# EAGLE design colecovision2 (EAGLE 7.4.0)
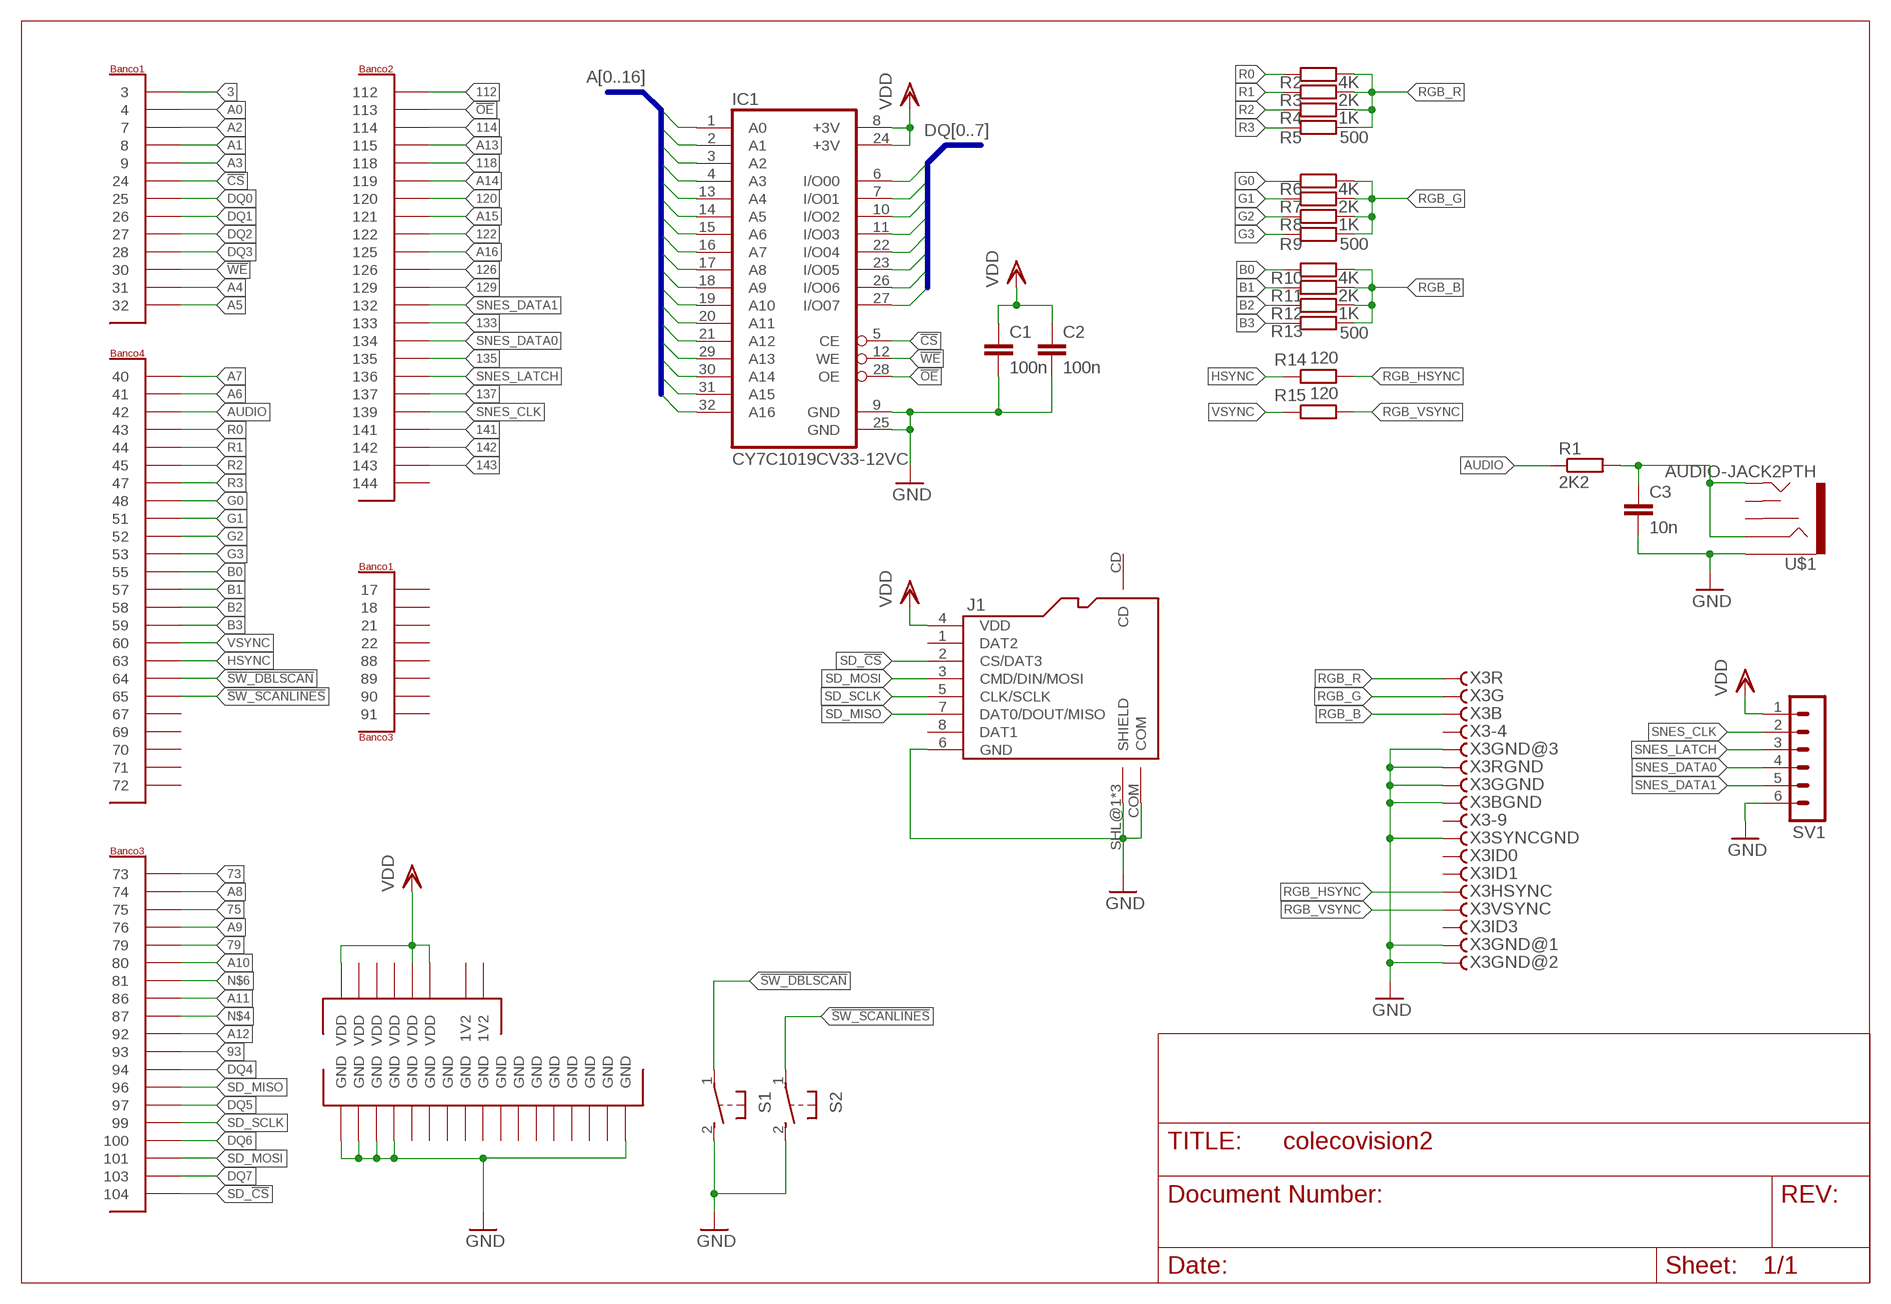
[diagram p0: schematic, sheet 1]

## Parts
C1  100n  C-EUC1206  [C1206]
C2  100n  C-EUC1206  [C1206]
C3  10n  C-EUC1206  [C1206]
IC1  CY7C1019CV33-12VC  [SOJ32-400]
J1  MICROSD-9P  [9P-SMD-W/-RING]
PLC1  PLACAEP2C5LASER  [4X28_LASER]
R1  2K2  R-EU_R1206  [R1206]
R2  4K  R-EU_R1206  [R1206]
R3  2K  R-EU_R1206  [R1206]
R4  1K  R-EU_R1206  [R1206]
R5  500  R-EU_R1206  [R1206]
R6  4K  R-EU_R1206  [R1206]
R7  2K  R-EU_R1206  [R1206]
R8  1K  R-EU_R1206  [R1206]
R9  500  R-EU_R1206  [R1206]
R10  4K  R-EU_R1206  [R1206]
R11  2K  R-EU_R1206  [R1206]
R12  1K  R-EU_R1206  [R1206]
R13  500  R-EU_R1206  [R1206]
R14  120  R-EU_R1206  [R1206]
R15  120  R-EU_R1206  [R1206]
S1  31-XX  [B3F-31XX]
S2  31-XX  [B3F-31XX]
SV1  MA06-1  [MA06-1]
U$1  AUDIO-JACK2PTH  [AUDIO-JACK]
X3  VGAH  [HDF15H]

## Nets
3: PLC1.P$3
73: PLC1.P$59
75: PLC1.P$61
79: PLC1.P$63
93: PLC1.P$73
112: PLC1.P$87
114: PLC1.P$89
118: PLC1.P$91
120: PLC1.P$93
122: PLC1.P$95
126: PLC1.P$97
129: PLC1.P$98
133: PLC1.P$100
135: PLC1.P$102
137: PLC1.P$104
141: PLC1.P$106
142: PLC1.P$107
143: PLC1.P$108
!CS: IC1.5(CE) PLC1.P$16
!OE: IC1.28(OE) PLC1.P$88
!SW_DBLSCAN: PLC1.P$46 S1.1(P)
!SW_SCANLINES: PLC1.P$47 S2.1(P)
!WE: IC1.12(WE) PLC1.P$21
A0: IC1.1(A0) PLC1.P$4
A1: IC1.2(A1) PLC1.P$6
A2: IC1.3(A2) PLC1.P$5
A3: IC1.4(A3) PLC1.P$7
A4: IC1.13(A4) PLC1.P$24
A5: IC1.14(A5) PLC1.P$23
A6: IC1.15(A6) PLC1.P$30
A7: IC1.16(A7) PLC1.P$29
A8: IC1.17(A8) PLC1.P$60
A9: IC1.18(A9) PLC1.P$62
A10: IC1.19(A10) PLC1.P$64
A11: IC1.20(A11) PLC1.P$66
A12: IC1.21(A12) PLC1.P$72
A13: IC1.29(A13) PLC1.P$90
A14: IC1.30(A14) PLC1.P$92
A15: IC1.31(A15) PLC1.P$94
A16: IC1.32(A16) PLC1.P$96
AUDIO: PLC1.P$31 R1.1
B0: PLC1.P$40 R10.1
B1: PLC1.P$41 R11.1
B2: PLC1.P$42 R12.1
B3: PLC1.P$43 R13.1
DQ0: IC1.6(I/O00) PLC1.P$15
DQ1: IC1.7(I/O01) PLC1.P$18
DQ2: IC1.10(I/O02) PLC1.P$17
DQ3: IC1.11(I/O03) PLC1.P$22
DQ4: IC1.22(I/O04) PLC1.P$74
DQ5: IC1.23(I/O05) PLC1.P$76
DQ6: IC1.26(I/O06) PLC1.P$78
DQ7: IC1.27(I/O07) PLC1.P$80
G0: PLC1.P$36 R6.1
G1: PLC1.P$37 R7.1
G2: PLC1.P$38 R8.1
G3: PLC1.P$39 R9.1
GND: C1.2 C2.2 C3.2 IC1.9(GND) IC1.25(GND) J1.6(GND) J1.COM J1.SHL@1(SHIELD) J1.SHL@2(SHIELD) J1.SHL@3(SHIELD) PLC1.P$1(GND) PLC1.P$2(GND) PLC1.P$8(GND) PLC1.P$9(GND) PLC1.P$111(GND) S1.2(S) S2.2(S) SV1.6 U$1.SLEEVE X3.5 X3.6 X3.7 X3.8 X3.10 X3.GND@1 X3.GND@2
HSYNC: PLC1.P$45 R14.1
N$1: C3.1 R1.2 U$1.RING U$1.TIP
N$4: PLC1.P$67
N$6: PLC1.P$65
R0: PLC1.P$32 R2.1
R1: PLC1.P$33 R3.1
R2: PLC1.P$34 R4.1
R3: PLC1.P$35 R5.1
RGB_B: R10.2 R11.2 R12.2 R13.2 X3.3
RGB_G: R6.2 R7.2 R8.2 R9.2 X3.2
RGB_HSYNC: R14.2 X3.13
RGB_R: R2.2 R3.2 R4.2 R5.2 X3.1
RGB_VSYNC: R15.2 X3.14
SD_!CS: J1.2(CS/DAT3) PLC1.P$81
SD_MISO: J1.7(DAT0/DOUT/MISO) PLC1.P$75
SD_MOSI: J1.3(CMD/DIN/MOSI) PLC1.P$79
SD_SCLK: J1.5(CLK/SCLK) PLC1.P$77
SNES_CLK: PLC1.P$105 SV1.2
SNES_DATA0: PLC1.P$101 SV1.4
SNES_DATA1: PLC1.P$99 SV1.5
SNES_LATCH: PLC1.P$103 SV1.3
VDD: C1.1 C2.1 IC1.8(+3V) IC1.24(+3V) J1.4(VDD) PLC1.P$27(VDD) PLC1.P$84(VDD) PLC1.P$112(VDD) SV1.1
VSYNC: PLC1.P$44 R15.1
Unconnected: J1.1(DAT2) J1.8(DAT1) J1.CD PLC1.P$11 PLC1.P$12 PLC1.P$13 PLC1.P$14 PLC1.P$48 PLC1.P$49 PLC1.P$50 PLC1.P$51 PLC1.P$52 PLC1.P$68 PLC1.P$69 PLC1.P$70 PLC1.P$71 PLC1.P$109 U$1.RSH U$1.TSH X3.4 X3.9 X3.11 X3.12 X3.15

## Buses
A[0..16]
DQ[0..7]

## Power pins joined to a net without a drawn wire
1V2: PLC1.P$19(1V2) PLC1.P$20(1V2)
GND: PLC1.P$10(GND) PLC1.P$25(GND) PLC1.P$26(GND) PLC1.P$53(GND) PLC1.P$54(GND) PLC1.P$57(GND) PLC1.P$58(GND) PLC1.P$82(GND) PLC1.P$83(GND) PLC1.P$85(GND) PLC1.P$86(GND) PLC1.P$110(GND)
VDD: PLC1.P$28(VDD) PLC1.P$55(VDD) PLC1.P$56(VDD)

## Library data of the parts
C1-C3 = rcl:C-EU: CAPACITOR, European symbol
IC1 = sram:CY7C1019CV33: 128K x 8 Static RAM 10ns Source: Cypress CYP05780611.pdf
J1 = fabio:MICROSD-9P: Micro SD 9 pins
PLC1 = placaEP2:PLACAEP2C5: Placa EP2C5
R1-R15 = rcl:R-EU_: RESISTOR, European symbol
S1 S2 = switch-omron:31-XX: OMRON SWITCH; MPN: B3F-3100; OC_FARNELL: 959704; OC_NEWARK: 36M3582
SV1 = con-lstb2:MA06-1: PIN HEADER; OC_FARNELL: unknown; OC_NEWARK: unknown
U$1 = fabio:AUDIO-JACK2: Stereo audio jack with bypass switches.
X3 = fabio:VGA: SUB-D; OC_FARNELL: unknown; OC_NEWARK: unknown

## Board
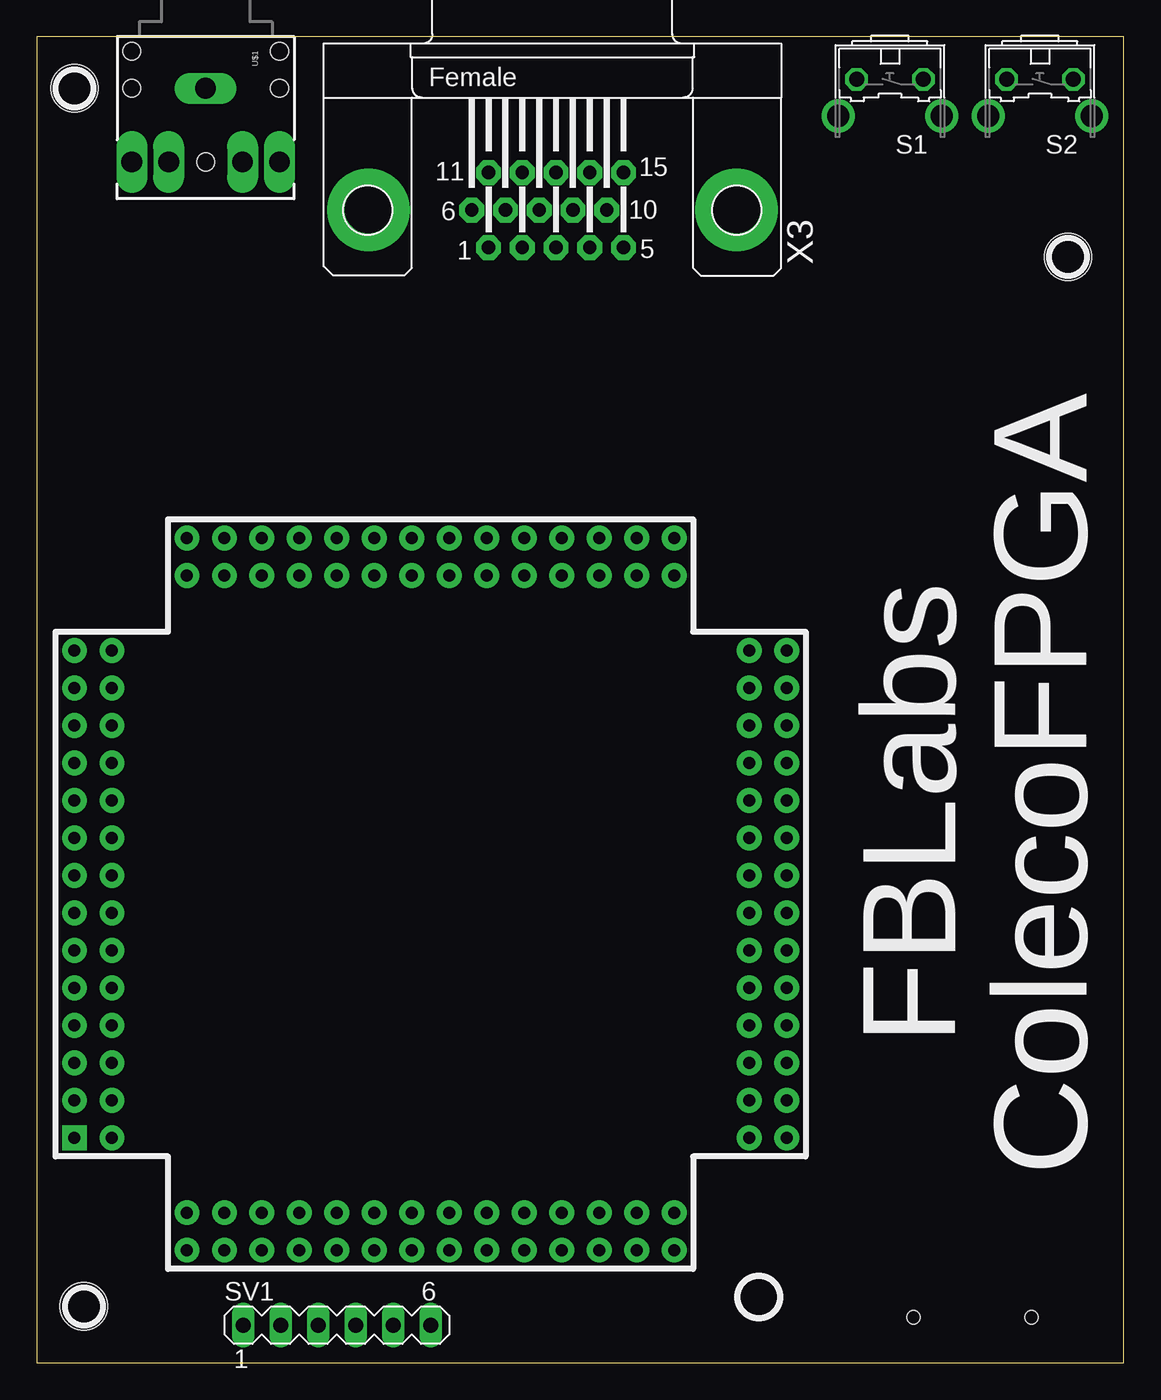
[diagram p1: board, top side]
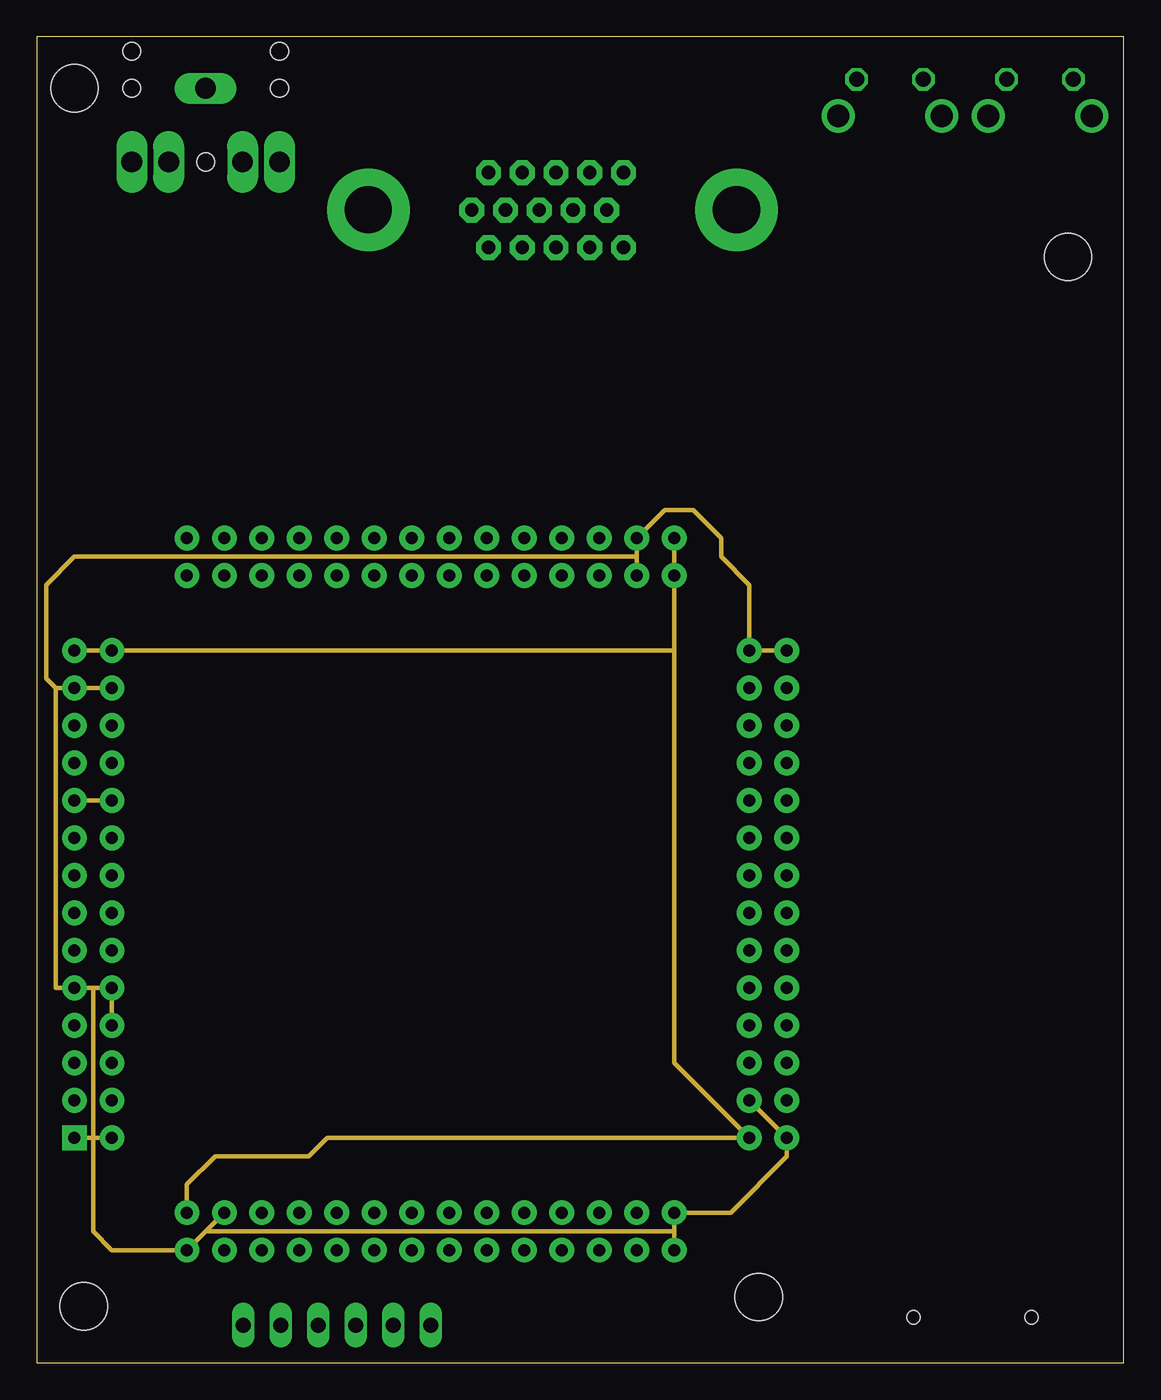
[diagram p2: board, inner layer Route8]
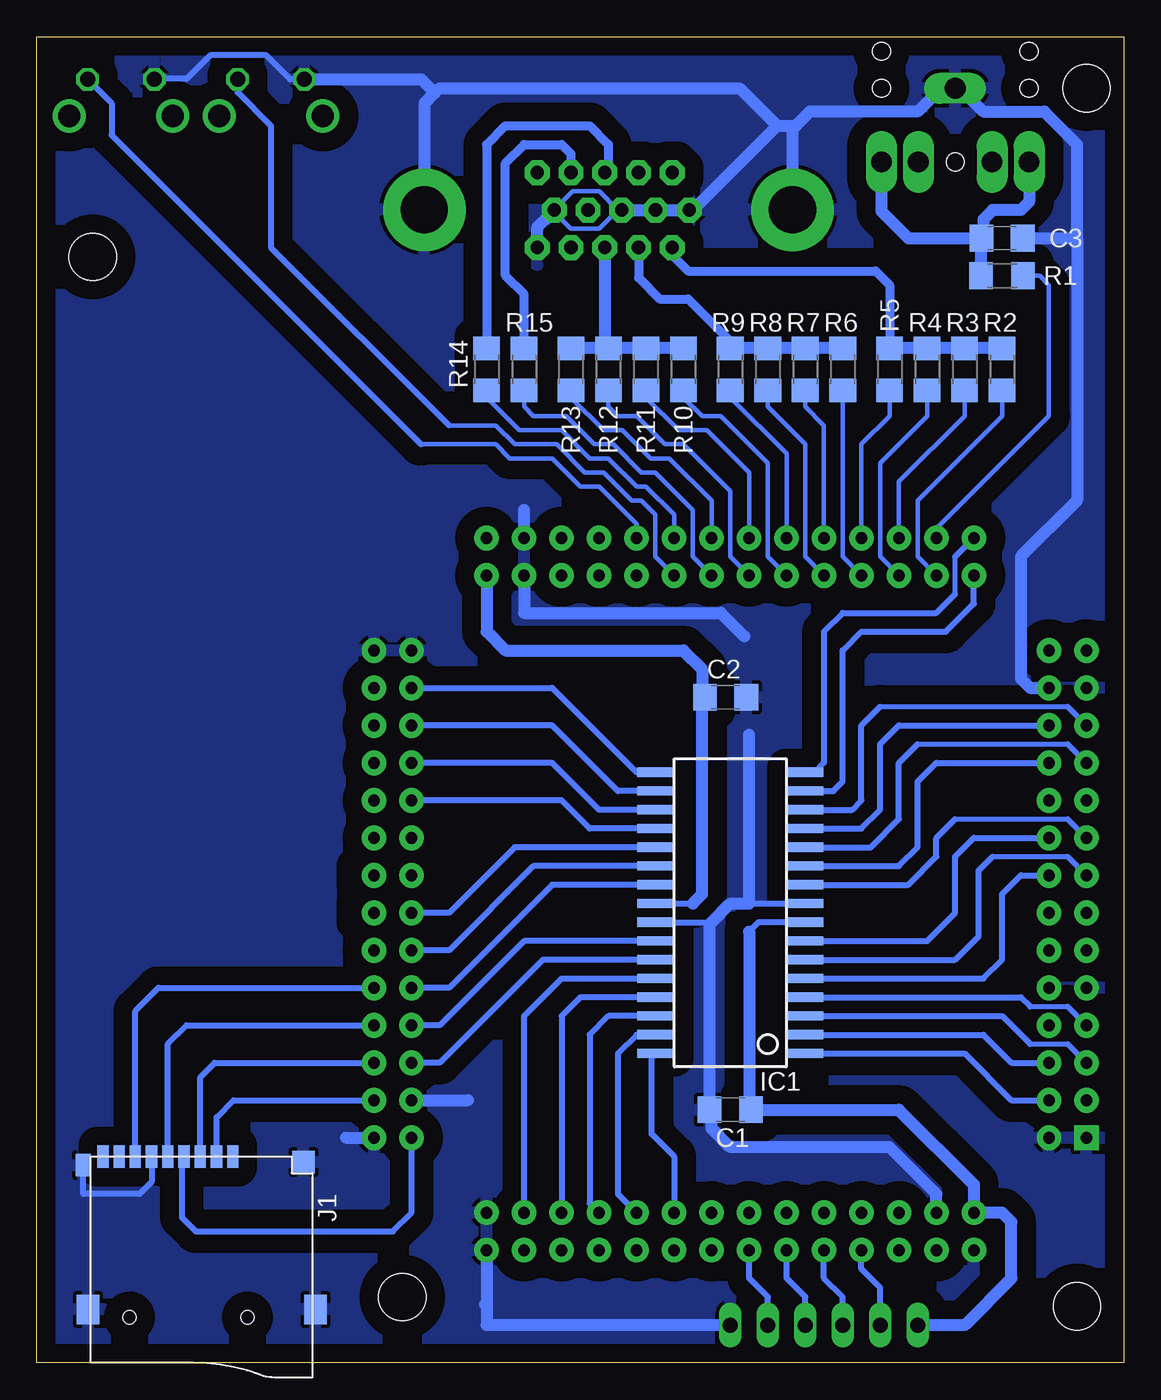
[diagram p3: board, bottom side, seen from below]

Size 73.64 x 89.84 mm. Coordinates in mm from the lower left corner, seen from the top.
Outline: 0,0 73.64,0 73.64,89.84 0,89.84 0,0
Copper layers (1*8*16): Top 0.035mm / dielectric 1.5mm / Route8 0.035mm / dielectric 0.15mm / Bottom 0.035mm
Design rules "Impressao Laser *": minimum track width 10mil, minimum drill 23mil, track to track 10mil, track to pad 10mil, pad to pad 10mil, via to via 10mil, smd to smd 10mil, copper to edge 20mil, drill to drill 10mil, minimum pad ring 10mil, minimum via ring 12mil, stop-mask expansion 4mil, vias tented up to drill 0mil, thermal gap 10mil
Holes 3.2 mm at 69.85,74.93 48.9,4.45 3.17,3.81 2.54,86.36
bRestrict: area 50.2,29.8 to 52.1,31.1; area 1.3,29.8 to 5.7,31.1; area 47,34.9 to 48.3,36.2; area 1.3,27.3 to 5.7,28.6; area 47.6,32.4 to 52.1,33.7

### Footprints (pad centres in the part's own frame; a part is rotated, then mirrored left to right if it is on the bottom)
C1206 = smd 1.6 x 1.8: 1 -1.4,0; 2 1.4,0
SOJ32-400 = smd 0.635 x 2.54: 1 -9.525,-5.016; 2 -8.255,-5.016; 3 -6.985,-5.016; 4 -5.715,-5.016; 5 -4.445,-5.016; 6 -3.175,-5.016; 7 -1.905,-5.016; 8 -0.635,-5.016; 9 0.635,-5.016; 10 1.905,-5.016; 11 3.175,-5.016; 12 4.445,-5.016; 13 5.715,-5.016; 14 6.985,-5.016; 15 8.255,-5.016; 16 9.525,-5.016; 17 9.525,5.016; 18 8.255,5.016; 19 6.985,5.016; 20 5.715,5.016; 21 4.445,5.016; 22 3.175,5.016; 23 1.905,5.016; 24 0.635,5.016; 25 -0.635,5.016; 26 -1.905,5.016; 27 -3.175,5.016; 28 -4.445,5.016; 29 -5.715,5.016; 30 -6.985,5.016; 31 -8.255,5.016; 32 -9.525,5.016
9P-SMD-W/-RING = smd 1.524 x 0.762: 1 0,4.4; 2 0,3.3; 3 0,2.2; 4 0,1.1; 5 0,0; 6 0,-1.1; 7 0,-2.2; 8 0,-3.3; CD 0,-4.4 | smd 1.524 x 1.016: COM 0.6,-5.746 | smd 1.524 x 1.524: SHL@1 0.392,9.181 | smd 2.032 x 1.524: SHL@2 10.373,10; SHL@3 10.373,-5.4 | hole 0.889: 10.9,-2.6; 10.9,5.4
4X28_LASER = drill 0.8 pad 1.676 square: P$1 22.86,15.24 | drill 0.8 pad 1.676: P$2 20.32,15.24; P$3 22.86,12.7; P$4 20.32,12.7; P$5 22.86,10.16; P$6 20.32,10.16; P$7 22.86,7.62; P$8 20.32,7.62; P$9 22.86,5.08; P$10 20.32,5.08; P$11 22.86,2.54; P$12 20.32,2.54; P$13 22.86,0; P$14 20.32,0; P$15 22.86,-2.54; P$16 20.32,-2.54; P$17 22.86,-5.08; P$18 20.32,-5.08; P$19 22.86,-7.62; P$20 20.32,-7.62; P$21 22.86,-10.16; P$22 20.32,-10.16; P$23 22.86,-12.7; P$24 20.32,-12.7; P$25 22.86,-15.24; P$26 20.32,-15.24; P$27 22.86,-17.78; P$28 20.32,-17.78; P$29 15.24,-25.4; P$30 15.24,-22.86; P$31 12.7,-25.4; P$32 12.7,-22.86; P$33 10.16,-25.4; P$34 10.16,-22.86; P$35 7.62,-25.4; P$36 7.62,-22.86; P$37 5.08,-25.4; P$38 5.08,-22.86; P$39 2.54,-25.4; P$40 2.54,-22.86; P$41 0,-25.4; P$42 0,-22.86; P$43 -2.54,-25.4; P$44 -2.54,-22.86; P$45 -5.08,-25.4; P$46 -5.08,-22.86; P$47 -7.62,-25.4; P$48 -7.62,-22.86; P$49 -10.16,-25.4; P$50 -10.16,-22.86; P$51 -12.7,-25.4; P$52 -12.7,-22.86; P$53 -15.24,-25.4; P$54 -15.24,-22.86; P$55 -17.78,-25.4; P$56 -17.78,-22.86; P$57 -25.4,-17.78; P$58 -22.86,-17.78; P$59 -25.4,-15.24; P$60 -22.86,-15.24; P$61 -25.4,-12.7; P$62 -22.86,-12.7; P$63 -25.4,-10.16; P$64 -22.86,-10.16; P$65 -25.4,-7.62; P$66 -22.86,-7.62; P$67 -25.4,-5.08; P$68 -22.86,-5.08; P$69 -25.4,-2.54; P$70 -22.86,-2.54; P$71 -25.4,0; P$72 -22.86,0; P$73 -25.4,2.54; P$74 -22.86,2.54; P$75 -25.4,5.08; P$76 -22.86,5.08; P$77 -25.4,7.62; P$78 -22.86,7.62; P$79 -25.4,10.16; P$80 -22.86,10.16; P$81 -25.4,12.7; P$82 -22.86,12.7; P$83 -25.4,15.24; P$84 -22.86,15.24; P$85 -17.78,22.86; P$86 -17.78,20.32; P$87 -15.24,22.86; P$88 -15.24,20.32; P$89 -12.7,22.86; P$90 -12.7,20.32; P$91 -10.16,22.86; P$92 -10.16,20.32; P$93 -7.62,22.86; P$94 -7.62,20.32; P$95 -5.08,22.86; P$96 -5.08,20.32; P$97 -2.54,22.86; P$98 -2.54,20.32; P$99 0,22.86; P$100 0,20.32; P$101 2.54,22.86; P$102 2.54,20.32; P$103 5.08,22.86; P$104 5.08,20.32; P$105 7.62,22.86; P$106 7.62,20.32; P$107 10.16,22.86; P$108 10.16,20.32; P$109 12.7,22.86; P$110 12.7,20.32; P$111 15.24,22.86; P$112 15.24,20.32
R1206 = smd 1.6 x 1.803: 1 -1.422,0; 2 1.422,0
B3F-31XX = drill 1.016 octagon: 1 -2.261,-1.245; 2 2.261,-1.245 | drill 1.499 pad 2.159: 3 -3.505,1.245; 4 3.505,1.245
MA06-1 = drill 1.016 long: 1 -6.35,0; 2 -3.81,0; 3 -1.27,0; 4 1.27,0; 5 3.81,0; 6 6.35,0
AUDIO-JACK = drill 1.4 pad 1.829 long: RING 5,5; RSH 5,2.5; TIP 5,-5; TSH 5,-2.5 | drill 1.4 long: SLEEVE 0,0 | hole 1.2: 0,5; -2.5,5; -2.5,-5; 0,-5; 5,0
HDF15H = drill 0.9 pad 1.676 octagon: 1 4.329,2.54; 2 2.043,2.54; 3 -0.243,2.54; 4 -2.529,2.54; 5 -4.815,2.54; 6 5.472,0; 7 3.186,0; 8 0.9,0; 9 -1.386,0; 10 -3.672,0; 11 4.329,-2.54; 12 2.043,-2.54; 13 -0.243,-2.54; 14 -2.529,-2.54; 15 -4.815,-2.54 | drill 3.2 pad 5.588: GND@1 -12.471,-0.025; GND@2 12.471,-0.025

### Placement (x,y rotation side)
C1  26.67,17.14 180 bottom
C2  26.99,45.09 0 bottom
C3  8.26,76.2 0 bottom
IC1  26.67,30.48 90 bottom
J1  64.77,13.97 270 bottom
PLC1  25.4,30.48 180 top
R1  8.26,73.66 180 bottom
R2  8.26,67.31 90 bottom
R3  10.79,67.31 90 bottom
R4  13.34,67.31 90 bottom
R5  15.88,67.31 90 bottom
R6  19.05,67.31 90 bottom
R7  21.59,67.31 90 bottom
R8  24.13,67.31 90 bottom
R9  26.67,67.31 90 bottom
R10  29.84,67.31 90 bottom
R11  32.38,67.31 90 bottom
R12  34.92,67.31 90 bottom
R13  37.47,67.31 90 bottom
R14  43.18,67.31 90 bottom
R15  40.64,67.31 90 bottom
S1  57.78,85.72 180 top
S2  67.94,85.72 180 top
SV1  20.32,2.54 0 top
U$1  11.43,86.36 270 top
X3  34.92,78.11 180 top

### Tracks (layer width: path | path; a pad name or v marks a point on that pad's centre or on a via)
1V2
  Route8 0.305: PLC1.P$19 PLC1.P$20
!CS
  Bottom 0.406: IC1.5 9.53,26.04 8.26,27.3 8.26,31.75 6.99,33.02 PLC1.P$16
!OE
  Bottom 0.406: PLC1.P$88 40.64,23.5 38.1,26.04 IC1.28
!SW_DBLSCAN
  Bottom 0.305: PLC1.P$46 31.75,54.61 31.75,57.47 32.7,58.42 33.34,58.42 35.24,60.33 36.51,60.33 38.42,62.23 41.27,62.23 42.55,63.5 45.72,63.5
  Bottom 0.406: S1.1 60.05,86.08 57.78,83.82 57.78,75.56 45.72,63.5
!SW_SCANLINES
  Bottom 0.305: PLC1.P$47 33.02,56.83 35.56,59.37 36.83,59.37 38.73,61.28 41.59,61.28 42.55,62.23 47.62,62.23
  Bottom 0.406: 47.62,62.23 68.58,83.19 68.58,85.34 S2.1
!WE
  Bottom 0.356: 13.97,41.91 3.81,41.91
  Bottom 0.406: IC1.12 17.14,34.92 15.24,36.83 15.24,40.64 13.97,41.91 | 3.81,41.91 PLC1.P$21
A0
  Bottom 0.406: IC1.1 10.79,20.95 7.62,17.78 PLC1.P$4
A1
  Bottom 0.406: IC1.2 9.53,22.23 7.62,20.32 PLC1.P$6
A2
  Bottom 0.356: 6.35,21.59 3.81,21.59
  Bottom 0.406: IC1.3 8.26,23.5 6.35,21.59 | 3.81,21.59 PLC1.P$5
A3
  Bottom 0.356: 6.35,24.13 3.81,24.13
  Bottom 0.406: IC1.4 6.99,24.77 6.35,24.13 | 3.81,24.13 PLC1.P$7
A4
  Bottom 0.406: IC1.13 17.78,36.2 16.51,37.47 16.51,41.91 15.24,43.18 PLC1.P$24
A5
  Bottom 0.356: 16.51,44.45 3.81,44.45
  Bottom 0.406: IC1.14 18.41,37.47 17.78,38.1 17.78,43.18 16.51,44.45 | 3.81,44.45 PLC1.P$23
A6
  Bottom 0.406: IC1.15 19.68,38.73 19.05,39.37 19.05,48.26 17.78,49.53 12.06,49.53 10.16,51.44 PLC1.P$30
A7
  Bottom 0.356: 11.43,52.07 11.43,54.61
  Bottom 0.406: 11.43,52.07 12.7,50.8 19.05,50.8 20.32,49.53 20.32,40.64 20.95,40.01 IC1.16 | 11.43,54.61 PLC1.P$29
A8
  Bottom 0.406: PLC1.P$60 38.73,45.72 33.02,40.01 IC1.17
A9
  Bottom 0.406: IC1.18 34.29,38.73 38.73,43.18 PLC1.P$62
A10
  Bottom 0.406: IC1.19 35.56,37.47 38.73,40.64 PLC1.P$64
A11
  Bottom 0.406: IC1.20 36.2,36.2 38.1,38.1 PLC1.P$66
A12
  Bottom 0.406: IC1.21 41.27,34.92 45.72,30.48 PLC1.P$72
A13
  Bottom 0.406: IC1.29 36.83,24.77 38.1,23.5 PLC1.P$90
A14
  Bottom 0.406: IC1.30 34.92,23.5 36.2,22.23 36.2,10.79 PLC1.P$92
A15
  Bottom 0.406: IC1.31 33.02,22.23 34.29,20.95 34.29,11.43 PLC1.P$94
A16
  Bottom 0.406: 31.75,20.95 IC1.32 32,20.64 32,15.49 30.48,13.97 PLC1.P$96
AUDIO
  Bottom 0.305: R1.1 5.71,73.66 5.08,73.03 5.08,64.14 12.7,56.52 PLC1.P$31
B0
  Bottom 0.305: R10.1 29.84,65.41 28.57,64.14 27.3,64.14 24.13,60.96 24.13,54.61 PLC1.P$40
B1
  Bottom 0.305: R11.1 32.38,65.41 30.16,63.18 28.26,63.18 25.4,60.33 PLC1.P$41
B2
  Bottom 0.305: R12.1 34.92,64.77 34.29,64.14 33.02,64.14 31.11,62.23 29.84,62.23 26.67,59.05 26.67,54.61 PLC1.P$42
B3
  Bottom 0.305: R13.1 37.47,65.41 35.24,63.18 33.97,63.18 32.07,61.28 30.8,61.28 27.94,58.42 PLC1.P$43
DQ0
  Bottom 0.356: 8.89,34.29 3.81,34.29
  Bottom 0.406: IC1.6 11.43,27.3 9.84,28.89 9.84,33.34 8.89,34.29 | 3.81,34.29 PLC1.P$15
DQ1
  Bottom 0.406: IC1.7 13.34,28.57 11.43,30.48 11.43,34.29 10.16,35.56 PLC1.P$18
DQ2
  Bottom 0.356: 11.43,36.83 3.81,36.83
  Bottom 0.406: IC1.10 14.61,32.38 12.7,34.29 12.7,35.56 11.43,36.83 | 3.81,36.83 PLC1.P$17
DQ3
  Bottom 0.406: IC1.11 15.24,33.66 13.97,34.92 13.97,39.37 12.7,40.64 PLC1.P$22
DQ4
  Bottom 0.406: IC1.22 40.01,33.66 45.72,27.94 PLC1.P$74
DQ5
  Bottom 0.406: IC1.23 38.73,32.38 45.72,25.4 PLC1.P$76
DQ6
  Bottom 0.406: IC1.26 40.64,28.57 46.35,22.86 PLC1.P$78
DQ7
  Bottom 0.406: IC1.27 39.37,27.3 46.35,20.32 PLC1.P$80
G0
  Bottom 0.305: R6.1 19.05,54.61 PLC1.P$36
G1
  Bottom 0.305: R7.1 21.59,64.77 20.32,63.5 PLC1.P$37
G2
  Bottom 0.305: R8.1 24.13,64.77 21.59,62.23 21.59,54.61 PLC1.P$38
G3
  Bottom 0.305: R9.1 26.67,65.41 22.86,61.59 PLC1.P$39
GND
  Route8 0.305: PLC1.P$57 PLC1.P$58 48.26,52.7 46.35,54.61 46.35,55.88 44.45,57.78 42.55,57.78 PLC1.P$53 40.64,54.61 | PLC1.P$82 PLC1.P$83 50.8,13.97 46.99,10.16 PLC1.P$86 43.18,8.89 | PLC1.P$85 43.18,8.89 | 3.81,25.4 PLC1.P$9 1.27,25.4 1.27,45.72 | 3.81,25.4 PLC1.P$10 PLC1.P$8 | PLC1.P$26 PLC1.P$25 1.27,45.72 | 40.64,54.61 PLC1.P$54 | 1.27,45.72 0.64,46.35 0.64,52.7 2.54,54.61 40.64,54.61 | PLC1.P$110 11.43,8.89 | 11.43,8.89 PLC1.P$111 5.08,7.62 3.81,8.89 3.81,15.24 | PLC1.P$1 3.81,15.24 | 3.81,15.24 PLC1.P$2 | 3.81,15.24 3.81,25.4 | 11.43,8.89 43.18,8.89
  Bottom 0.305: 34.29,78.11 35.56,79.38 37.33,79.38 X3.10 | X3.8 34.29,78.11 | 34.29,78.11 35.56,76.83 37.47,76.83 38.73,78.11
  Bottom 0.406: S1.2 56.49,86.97 58.1,88.58 61.91,88.58 63.5,87 65.66,87 S2.2 | IC1.25 27.94,29.84 28.07,29.71 | 25.4,31.11 IC1.9 | J1.6 65.87,12.23 66.67,11.43 70.48,11.43 70.48,13.34 J1.COM
  Bottom 0.61: X3.6 29.21,78.11 | 46.67,86.04 46.35,86.36 | 22.45,83.59 22.23,83.82
  Bottom 0.813: 3.17,76.2 3.17,82.55 5.4,84.77 9.53,84.77 11.11,86.36 U$1.SLEEVE 12.38,86.36 13.97,84.77 21.27,84.77 22.23,83.82 23.5,83.82 | C3.2 3.17,76.2 | X3.5 39.74,76.96 X3.10 | X3.8 X3.7 X3.6 | 29.21,78.11 23.5,83.82 | 46.35,86.36 26.04,86.36 23.5,83.82 | X3.GND@2 22.45,83.59 | PLC1.P$26 6.35,45.72 6.99,46.35 6.99,54.61 3.17,58.42 3.17,76.2 | SV1.6 43.18,2.54 43.18,3.81 | PLC1.P$85 43.18,3.81 | S1.2 47.6,86.97 46.67,86.04 47.4,85.32 X3.GND@1 | 27.94,29.84 26.67,31.11 25.4,31.11 25.4,42.55 | 28.07,29.71 C1.2 27.94,17.02 27.94,15.88 26.67,14.61 15.88,14.61 12.7,11.43 PLC1.P$110 | 52.7,15.24 PLC1.P$83 | 43.3,3.93 43.18,3.81 | PLC1.P$82 44.45,17.78 | PLC1.P$54 40.64,50.8 27.3,50.8 25.72,49.21 | PLC1.P$53 40.64,57.78
  pour Bottom (isolate 1.27): -1.27,91.44 75.56,91.44 75.56,-1.91 -1.27,-1.91
HSYNC
  Bottom 0.305: R14.1 43.18,65.41 40.96,63.18 38.1,63.18 36.2,61.28 34.92,61.28 33.02,59.37 32.38,59.37 30.48,57.47 PLC1.P$45
N$1
  Bottom 0.813: R1.2 9.68,75.56 | 9.68,75.56 9.68,76.18 C3.1 14.61,76.2 16.43,78.03 U$1.RING | U$1.TIP 6.43,78.66 6.99,78.11 8.89,78.11 9.53,77.47 9.53,75.72 9.68,75.56
R0
  Bottom 0.305: R2.1 8.26,64.14 13.97,58.42 13.97,54.61 PLC1.P$32
R1
  Bottom 0.305: R3.1 10.79,64.14 15.24,59.69 PLC1.P$33
R2
  Bottom 0.305: R4.1 13.34,64.14 16.51,60.96 16.51,54.61 PLC1.P$34
R3
  Bottom 0.305: R5.1 15.88,64.14 17.78,62.23 PLC1.P$35
RGB_B
  Bottom 0.813: R10.2 R11.2 R12.2 | R12.2 R13.2 | X3.3 35.17,68.97 R12.2
RGB_G
  Bottom 0.61: X3.2 32.88,73.52 31.43,72.07 29.53,72.07 26.67,69.22 R9.2
  Bottom 0.813: R6.2 R7.2 R8.2 | R8.2 24.13,68.58 | R8.2 R9.2
RGB_HSYNC
  Bottom 0.61: X3.13 34.92,80.89 34.92,82.55 36.2,83.82 41.91,83.82 43.18,82.55 R14.2
RGB_R
  Bottom 0.61: X3.1 30.6,75.05 29.53,73.98 16.83,73.98 15.88,73.03 R5.2
  Bottom 0.813: R2.2 R3.2 R4.2 R5.2
RGB_VSYNC
  Bottom 0.61: X3.14 37.47,80.66 37.47,81.92 38.1,82.55 40.64,82.55 41.91,81.28 41.91,73.66 40.64,72.39 R15.2
SD_!CS
  Bottom 0.406: J1.2 61.47,16.64 60.33,17.78 PLC1.P$81
SD_MISO
  Bottom 0.406: J1.7 66.97,23.84 65.41,25.4 PLC1.P$75
SD_MOSI
  Bottom 0.406: J1.3 62.57,19.34 61.59,20.32 PLC1.P$79
SD_SCLK
  Bottom 0.406: J1.5 64.77,21.59 63.5,22.86 PLC1.P$77
SNES_CLK
  Bottom 0.406: SV1.2 16.51,5.08 17.78,6.35 PLC1.P$105
SNES_DATA0
  Bottom 0.406: SV1.4 21.59,4.45 22.86,5.71 PLC1.P$101
SNES_DATA1
  Bottom 0.406: SV1.5 24.13,4.45 25.4,5.71 PLC1.P$99
SNES_LATCH
  Bottom 0.406: SV1.3 19.05,4.45 20.32,5.71 PLC1.P$103
VDD
  Route8 0.305: PLC1.P$27 PLC1.P$28 43.18,48.26 | 43.18,48.26 PLC1.P$56 PLC1.P$55 | 43.18,48.26 43.18,20.32 PLC1.P$84 19.68,15.24 18.41,13.97 12.06,13.97 10.16,12.06 PLC1.P$112
  Bottom 0.406: IC1.24 29.21,31.11 | IC1.8 24.77,29.84 25.4,29.21 | 25.4,17.27 C1.1 | J1.4 63.82,13.97 | 63.82,13.97 63.82,14.29 | 63.82,13.97 63.82,9.84 62.87,8.89 49.53,8.89 48.26,10.16 PLC1.P$84
  Bottom 0.813: SV1.1 10.79,2.54 7.62,5.71 7.62,9.53 8.26,10.16 PLC1.P$112 10.16,12.06 15.24,17.14 C1.1 | 29.21,31.11 28.57,31.75 28.57,44.9 C2.1 28.57,45.27 28.57,46.99 29.84,48.26 41.91,48.26 43.18,49.53 PLC1.P$56 | 25.4,29.21 25.4,17.27
VSYNC
  Bottom 0.305: R15.1 40.64,64.77 40.01,64.14 37.78,64.14 35.88,62.23 34.61,62.23 32.7,60.33 31.75,60.33 29.21,57.78 29.21,54.61 PLC1.P$44

### Text on the board
tPlace: FBLabs | ColecoFPGA
ep2_impar: A7 / A6 / A5 / A4 / !WE / D3 / D2 / GND / VDD / D1 / D0 / !CE / A3 / A2 / A1 / A0 | A8 / A9 / A10 / A11 / A12 / D4 / D5 / VDD / GND / D6 / D7 / !OE / A13 / A14 / A15 / A16 | VCC / GND / 32 31 / 30 28 / +1V2 / 27 26 / 25 24 / 22 21 / 17 18 / GND / 9 GND / 7 8 / 3 4 / GND | GND / 74 73 / 76 75 / 80 79 / 86 81 / 88 87 / 90 89 / 92 91 / 94 93 / 97 96 / 100 99 / 103 101 / GND 104 / VCC GND
ep2_par: 41 40 / 43 42 / 45 44 / 48 47 / 52 51 / 55 53 / 58 57 / 60 59 / 64 63 / 67 65 / 70 69 / 72 71 / GND / VCC | GND VCC / 144 GND / 142 143 / 139 141 / 136 137 / 134 135 / 132 133 / 126 129 / 122 125 / 120 121 / 118 119 / 114 115 / 112 113 / GND